# EAGLE design DualMotorBoard (EAGLE 8.5.0)
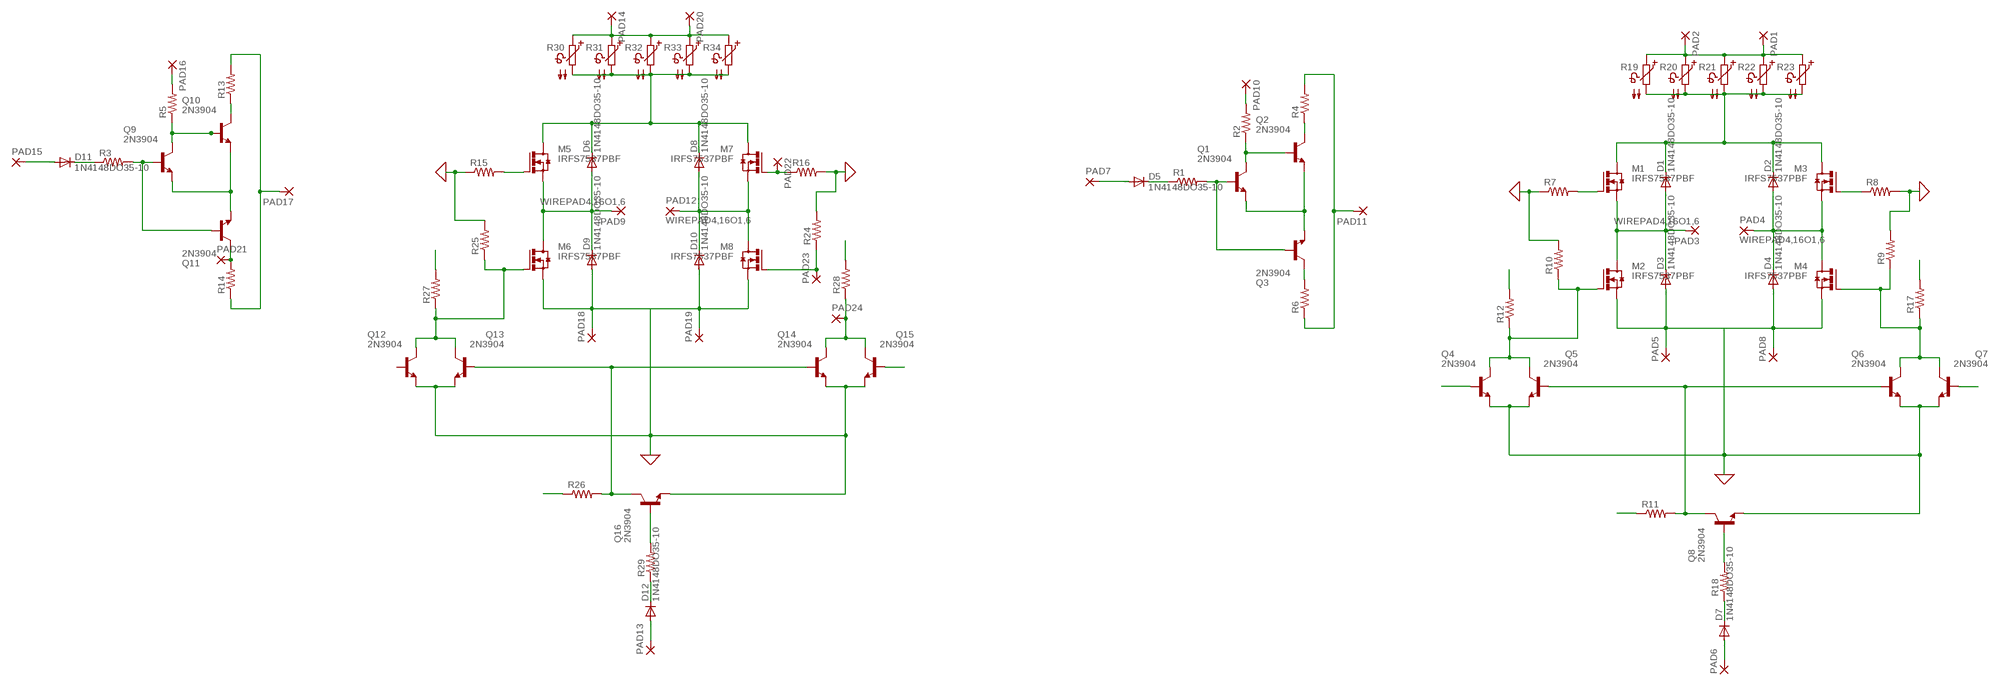
[diagram p0: schematic, sheet 1]

## Parts
D1  1N4148DO35-10  [DO35-10]
D2  1N4148DO35-10  [DO35-10]
D3  1N4148DO35-10  [DO35-10]
D4  1N4148DO35-10  [DO35-10]
D5  1N4148DO35-10  [DO35-10]
D6  1N4148DO35-10  [DO35-10]
D7  1N4148DO35-10  [DO35-10]
D8  1N4148DO35-10  [DO35-10]
D9  1N4148DO35-10  [DO35-10]
D10  1N4148DO35-10  [DO35-10]
D11  1N4148DO35-10  [DO35-10]
D12  1N4148DO35-10  [DO35-10]
M1  IRFS7537PBF  [D2PACK]
M2  IRFS7537PBF  [D2PACK]
M3  IRFS7537PBF  [D2PACK]
M4  IRFS7537PBF  [D2PACK]
M5  IRFS7537PBF  [D2PACK]
M6  IRFS7537PBF  [D2PACK]
M7  IRFS7537PBF  [D2PACK]
M8  IRFS7537PBF  [D2PACK]
PAD1  3,81/1,4  [3,81/1,4]
PAD2  3,81/1,4  [3,81/1,4]
PAD3  WIREPAD4,16O1,6  [4,16O1,6]
PAD4  WIREPAD4,16O1,6  [4,16O1,6]
PAD5  3,81/1,4  [3,81/1,4]
PAD6  2,54/1,1  [2,54/1,1]
PAD7  2,54/1,0  [2,54/1,0]
PAD8  3,81/1,4  [3,81/1,4]
PAD9  WIREPAD4,16O1,6  [4,16O1,6]
PAD10  2,54/1,1  [2,54/1,1]
PAD11  2,54/1,1  [2,54/1,1]
PAD12  WIREPAD4,16O1,6  [4,16O1,6]
PAD13  2,54/1,1  [2,54/1,1]
PAD14  3,81/1,4  [3,81/1,4]
PAD15  2,54/1,0  [2,54/1,0]
PAD16  2,54/1,1  [2,54/1,1]
PAD17  2,54/1,1  [2,54/1,1]
PAD18  3,81/1,4  [3,81/1,4]
PAD19  3,81/1,4  [3,81/1,4]
PAD20  3,81/1,4  [3,81/1,4]
PAD21  2,54/1,1  [2,54/1,1]
PAD22  2,54/1,1  [2,54/1,1]
PAD23  2,54/1,1  [2,54/1,1]
PAD24  2,54/1,1  [2,54/1,1]
Q1  2N3904  [TO92]
Q2  2N3904  [TO92]
Q3  2N3904  [TO92]
Q4  2N3904  [TO92]
Q5  2N3904  [TO92]
Q6  2N3904  [TO92]
Q7  2N3904  [TO92]
Q8  2N3904  [TO92]
Q9  2N3904  [TO92]
Q10  2N3904  [TO92]
Q11  2N3904  [TO92]
Q12  2N3904  [TO92]
Q13  2N3904  [TO92]
Q14  2N3904  [TO92]
Q15  2N3904  [TO92]
Q16  2N3904  [TO92]
R1  R-US_0207/7  [0207/7]
R2  R-US_0207/7  [0207/7]
R3  R-US_0207/7  [0207/7]
R4  R-US_0207/7  [0207/7]
R5  R-US_0207/7  [0207/7]
R6  R-US_0207/7  [0207/7]
R7  R-US_0207/7  [0207/7]
R8  R-US_0207/7  [0207/7]
R9  R-US_0207/7  [0207/7]
R10  R-US_0207/7  [0207/7]
R11  R-US_0207/7  [0207/7]
R12  R-US_0207/7  [0207/7]
R13  R-US_0207/7  [0207/7]
R14  R-US_0207/7  [0207/7]
R15  R-US_0207/7  [0207/7]
R16  R-US_0207/12  [0207/12]
R17  R-US_0207/7  [0207/7]
R18  R-US_0207/7  [0207/7]
R19  PTC660A  [P660A]
R20  PTC660A  [P660A]
R21  PTC660A  [P660A]
R22  PTC660A  [P660A]
R23  PTC660A  [P660A]
R24  R-US_0207/12  [0207/12]
R25  R-US_0207/7  [0207/7]
R26  R-US_0207/7  [0207/7]
R27  R-US_0207/7  [0207/7]
R28  R-US_0207/7  [0207/7]
R29  R-US_0207/7  [0207/7]
R30  PTC660A  [P660A]
R31  PTC660A  [P660A]
R32  PTC660A  [P660A]
R33  PTC660A  [P660A]
R34  PTC660A  [P660A]

## Nets
0: D3.A D4.A D9.A D10.A M2.3(S) M4.3(S) M6.3(S) M8.3(S) PAD5.1(P) PAD8.1(P) PAD18.1(P) PAD19.1(P) Q1.3(E) Q2.3(E) Q3.3(E) Q4.3(E) Q5.3(E) Q6.3(E) Q7.3(E) Q8.3(E) Q9.3(E) Q10.3(E) Q11.3(E) Q12.3(E) Q13.3(E) Q14.3(E) Q15.3(E) Q16.3(E) R7.1 R8.2 R9.2 R10.2 R15.1 R16.2 R24.2 R25.2 ; supply symbol labelled GND
BB: Q1.2(B) Q3.2(B) Q4.2(B) R1.2
BB1: Q9.2(B) Q11.2(B) R3.2
BF: M3.1(G) Q3.1(C) R6.2 R8.1
BFF: PAD21.1(P) Q11.1(C) R14.2
BFG: M7.1(G) PAD22.1(P) R16.1
DIR: D5.A PAD7.1(P)
DIR1: D11.A PAD15.1(P)
FB: Q1.1(C) Q2.2(B) Q7.2(B) R2.1
FB1: Q9.1(C) Q10.2(B) Q15.2(B) R5.1
FF: M1.1(G) Q2.1(C) R4.1 R7.2
FF1: M5.1(G) Q10.1(C) R13.1 R15.2
MN: D2.A D4.C M3.3(S) M4.2(D) PAD4.1(P)
MN1: D8.A D10.C M7.3(S) M8.2(D) PAD12.1(P)
MP: D1.A D3.C M1.3(S) M2.2(D) PAD3.1(P)
MP1: D6.A D9.C M5.3(S) M6.2(D) PAD9.1(P)
N$1: M8.1(G) PAD23.1(P) R24.1
N$2: D7.C R18.1
N$3: M6.1(G) Q12.1(C) Q13.1(C) R25.1 R27.1
N$4: D7.A PAD6.1(P)
N$5: PAD24.1(P) Q14.1(C) Q15.1(C) R28.1
N$6: Q13.2(B) Q14.2(B) Q16.1(C) R26.2
N$7: Q16.2(B) R29.2
N$8: D11.C R3.1
N$10: D12.C R29.1
N$11: D12.A PAD13.1(P)
N$16: Q5.2(B) Q6.2(B) Q8.1(C) R11.2
N$19: D5.C R1.1
N$20: M2.1(G) Q4.1(C) Q5.1(C) R10.1 R12.1
N$23: Q8.2(B) R18.2
N$27: M4.1(G) Q6.1(C) Q7.1(C) R9.1 R17.1
VBAT: PAD1.1(P) PAD2.1(P) PAD14.1(P) PAD20.1(P) R19.1 R20.1 R21.1 R22.1 R23.1 R30.1 R31.1 R32.1 R33.1 R34.1
VDD: D1.C D2.C M1.2(D) M3.2(D) R19.2 R20.2 R21.2 R22.2 R23.2
VDD1: D6.C D8.C M5.2(D) M7.2(D) R30.2 R31.2 R32.2 R33.2 R34.2
VG: PAD11.1(P) R4.2 R6.1 R12.2 R17.2
VG1: PAD17.1(P) R13.2 R14.1 R27.2 R28.2
VSW: PAD10.1(P) R2.2 R11.1
VSW1: PAD16.1(P) R5.2 R26.1
Unconnected: Q12.2(B)

## Library data of the parts
D1-D12 = diode:1N4148: DIODE high speed (Philips)
M1-M8 = EagleCAD:IRFS7537PBF: IRFS7537PBF Infineon International Rectifier DATASHEET: http://www.infineon.com/dgdl/irfs7537pbf.pdf?fileId=5546d462533600a4015364c3ee2729cb
PAD1 PAD2 PAD5 PAD8 PAD14 PAD18-PAD20 = wirepad:3,81/1,4: THROUGH-HOLE PAD
PAD3 PAD4 PAD9 PAD12 = wirepad:WIREPAD: Wire PAD connect wire on PCB
PAD6 PAD10 PAD11 PAD13 PAD16 PAD17 PAD21-PAD24 = wirepad:2,54/1,1: THROUGH-HOLE PAD
PAD7 PAD15 = wirepad:2,54/1,0: THROUGH-HOLE PAD
Q1-Q16 = transistor-npn:2N3904: NPN Transistor
R1-R13 R18 R26 R27 R29 = rcl:R-US_: RESISTOR, American symbol; SPICEPREFIX: R
R14-R17 R24 R25 R28 = resistor:R-US_: RESISTOR, American symbol
R19-R23 R30-R34 = ptc-ntc:PTC660A: PHILIPS PTC; OC_FARNELL: unknown; OC_NEWARK: unknown

## Board
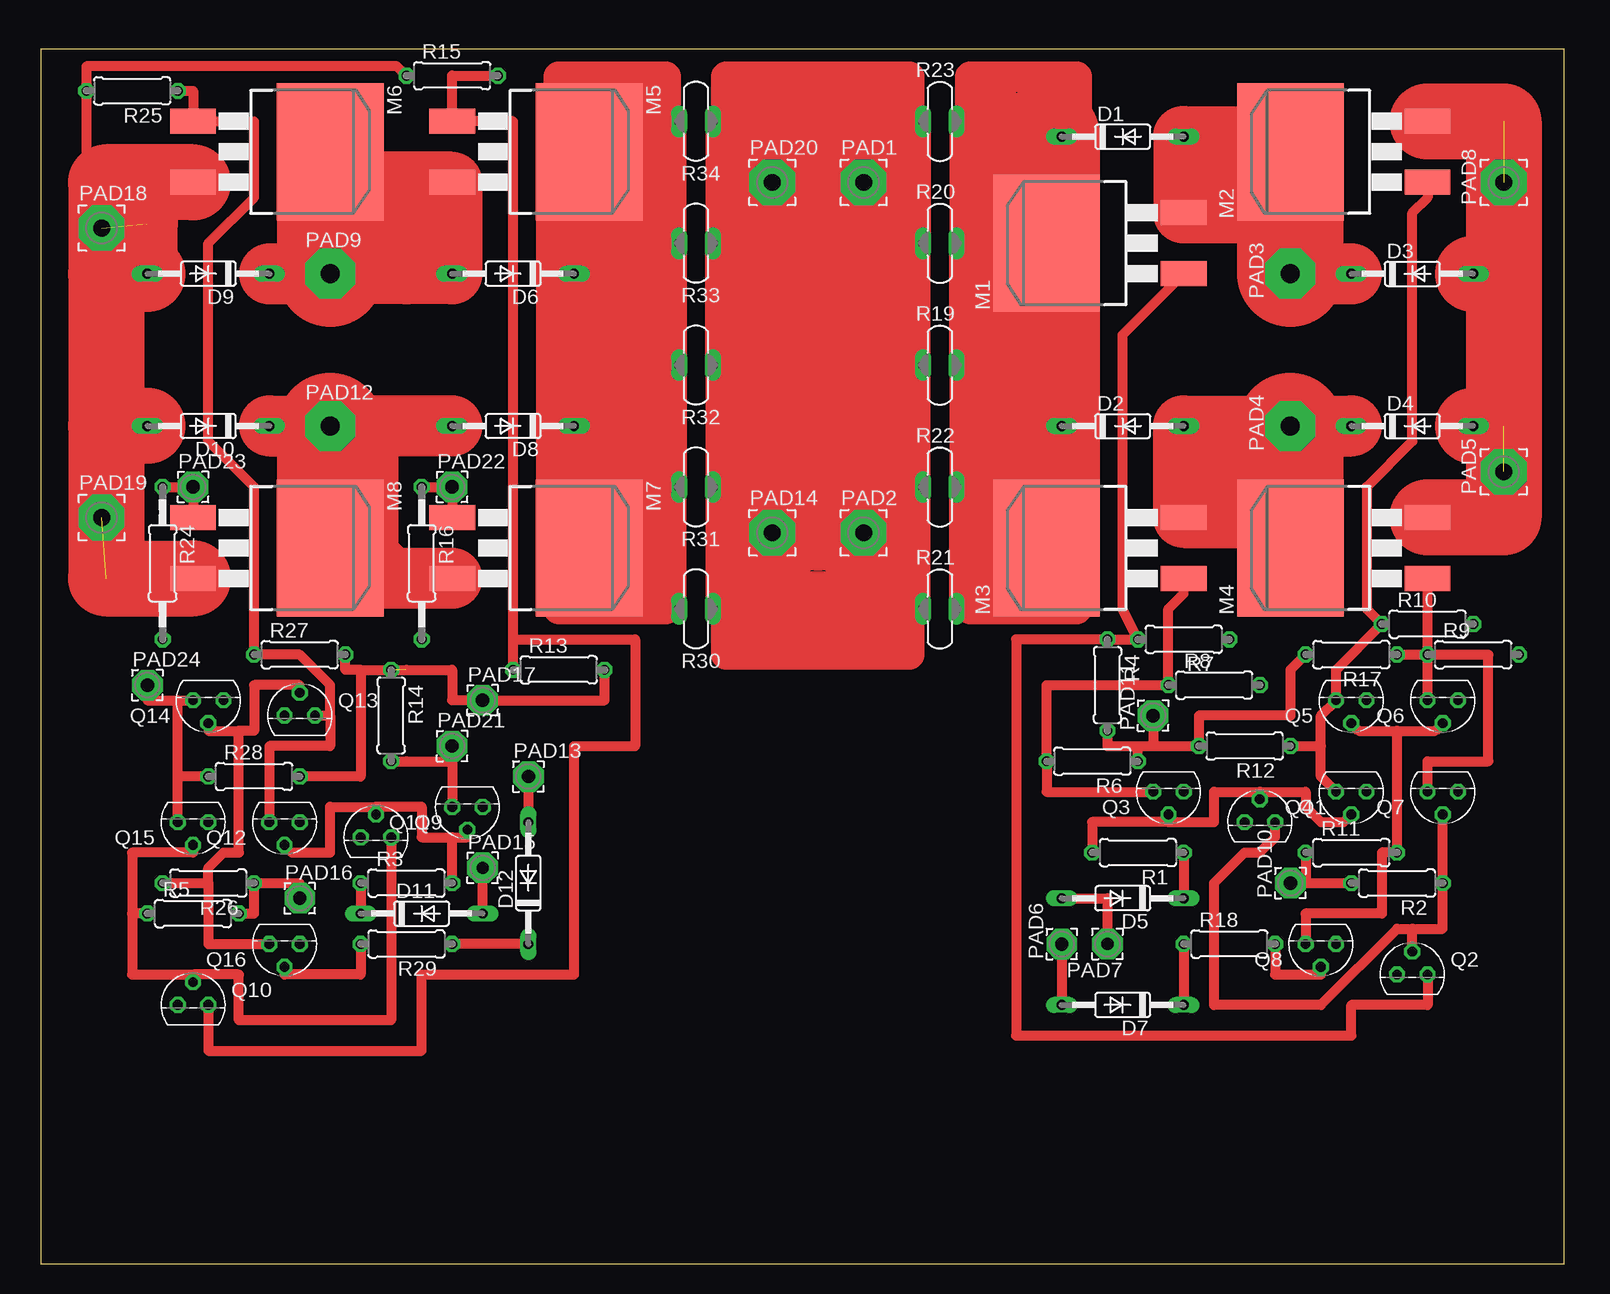
[diagram p1: board, top side]
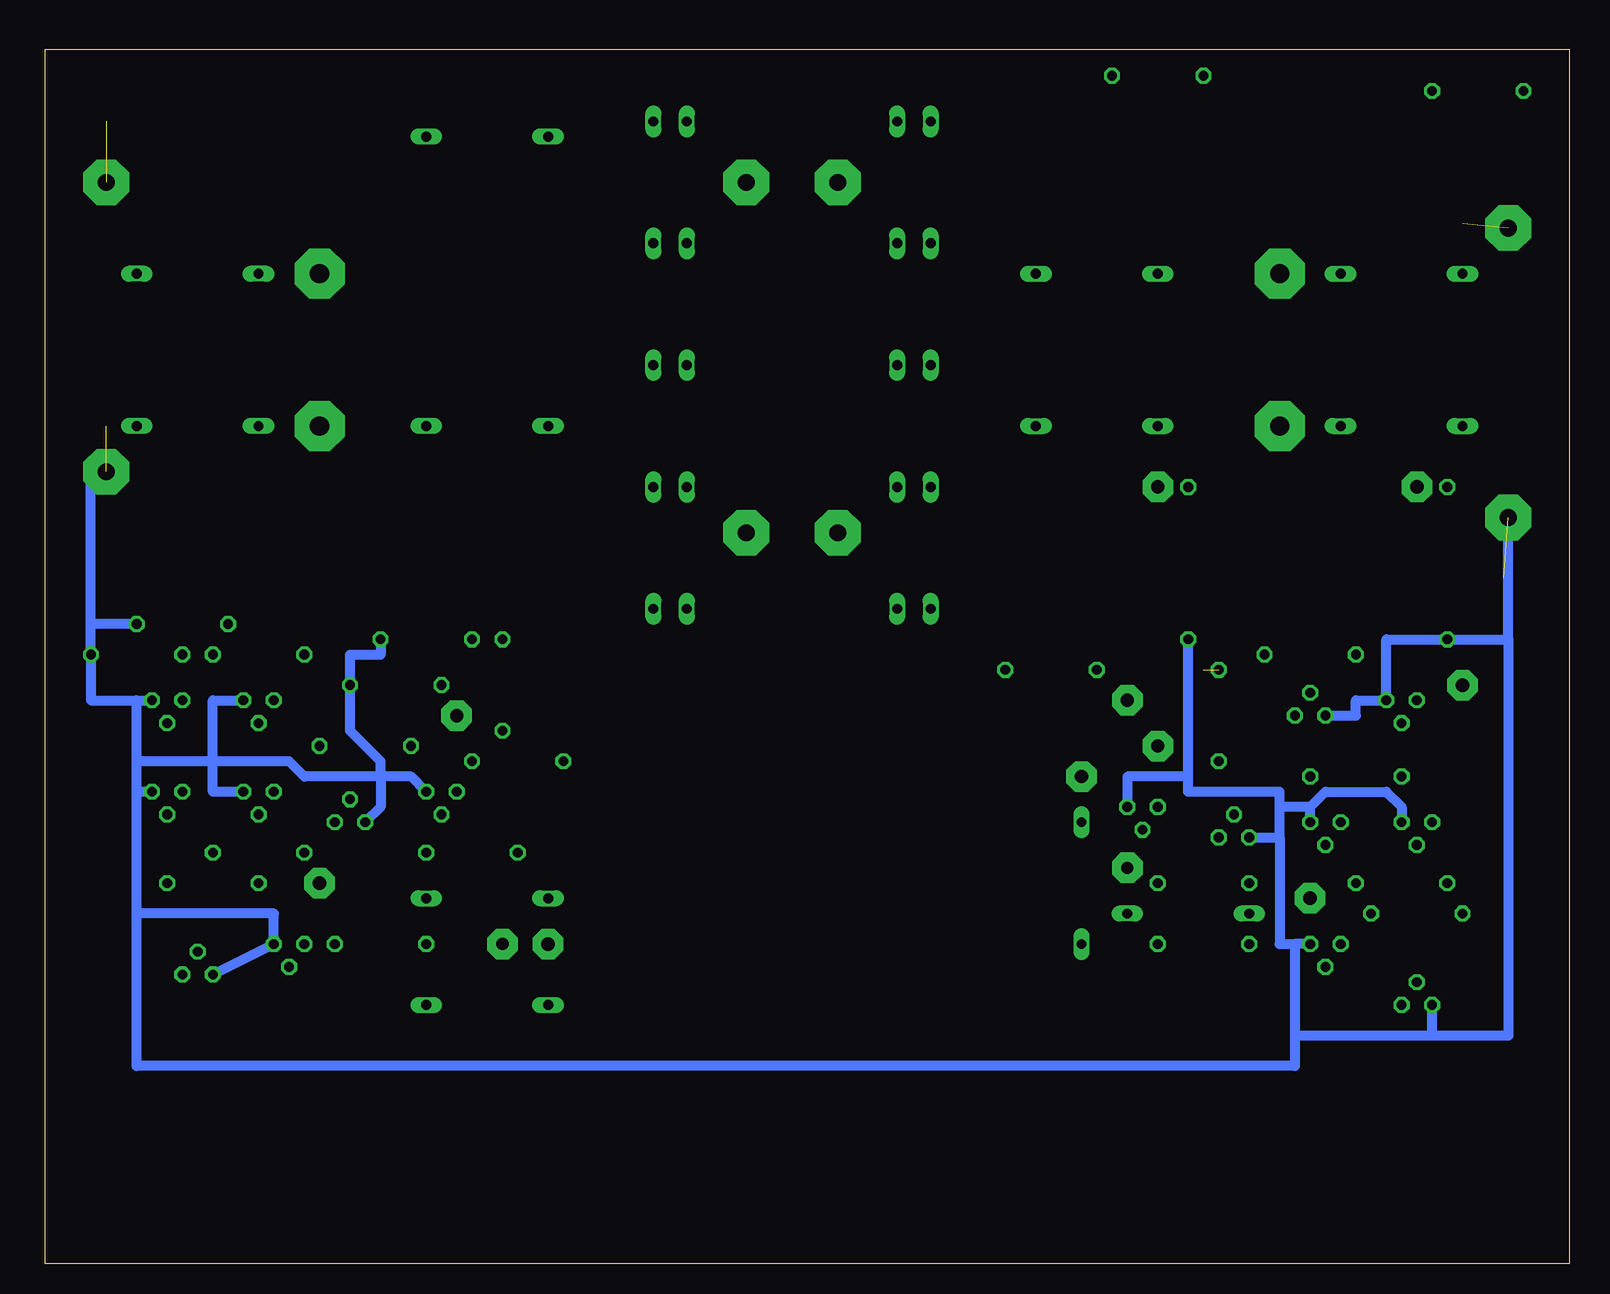
[diagram p2: board, bottom side, seen from below]

Size 126.98 x 101.27 mm. Coordinates in mm from the lower left corner, seen from the top.
Outline: 0,0 126.98,0 126.98,101.27 0,101.27 0,0
Copper layers (1*16): Top 0.035mm / dielectric 1.5mm / Bottom 0.035mm
Design rules "default": minimum track width 6mil, minimum drill 0.35mm, track to track 6mil, track to pad 6mil, pad to pad 6mil, via to via 6mil, smd to smd 6mil, copper to edge 40mil, drill to drill 6mil, minimum pad ring 10mil, minimum via ring 8mil, stop-mask expansion 4mil, vias tented up to drill 0mil, thermal gap 10mil

### Footprints (pad centres in the part's own frame; a part is rotated, then mirrored left to right if it is on the bottom)
DO35-10 = drill 0.813 long: A 5.08,0; C -5.08,0
D2PACK = smd 2.083 x 3.81: 1 -2.54,-8.89; 3 2.54,-8.89 | smd 11.43 x 8.89: 2 0,2.54
3,81/1,4 = drill 1.397 pad 3.81 octagon: 1 0,0
4,16O1,6 = drill 1.6 pad 4.166 octagon: 1 0,0
2,54/1,1 = drill 1.118 pad 2.54 octagon: 1 0,0
2,54/1,0 = drill 1.016 pad 2.54 octagon: 1 0,0
TO92 = drill 0.813 octagon: 1 1.27,0; 2 0,1.905; 3 -1.27,0
0207/7 = drill 0.813 octagon: 1 -3.81,0; 2 3.81,0
0207/12 = drill 0.813 octagon: 1 -6.35,0; 2 6.35,0
P660A = drill 0.813 long: 1 -1.397,0; 2 1.397,0

### Placement (x,y rotation side)
D1  90.17,93.98 0 top
D2  90.17,69.85 0 top
D3  114.3,82.55 0 top
D4  114.3,69.85 0 top
D5  90.17,30.48 180 top
D6  39.37,82.55 180 top
D7  90.17,21.59 180 top
D8  39.37,69.85 180 top
D9  13.97,82.55 180 top
D10  13.97,69.85 180 top
D11  31.75,29.21 0 top
D12  40.64,31.75 90 top
M1  86.36,85.09 90 top
M2  106.68,92.71 90 top
M3  86.36,59.69 90 top
M4  106.68,59.69 90 top
M5  43.18,92.71 270 top
M6  21.59,92.71 270 top
M7  43.18,59.69 270 top
M8  21.59,59.69 270 top
PAD1  68.58,90.17 0 top
PAD2  68.58,60.96 0 top
PAD3  104.14,82.55 90 top
PAD4  104.14,69.85 90 top
PAD5  121.92,66.04 90 top
PAD6  85.09,26.67 90 top
PAD7  88.9,26.67 180 top
PAD8  121.92,90.17 90 top
PAD9  24.13,82.55 0 top
PAD10  104.14,31.75 90 top
PAD11  92.71,45.72 90 top
PAD12  24.13,69.85 0 top
PAD13  40.64,40.64 0 top
PAD14  60.96,60.96 0 top
PAD15  36.83,33.02 0 top
PAD16  21.59,30.48 0 top
PAD17  36.83,46.99 0 top
PAD18  5.08,86.36 0 top
PAD19  5.08,62.23 0 top
PAD20  60.96,90.17 0 top
PAD21  34.29,43.18 0 top
PAD22  34.29,64.77 0 top
PAD23  12.7,64.77 0 top
PAD24  8.89,48.26 0 top
Q1  101.6,36.83 0 top
Q2  114.3,24.13 0 top
Q3  93.98,39.37 180 top
Q4  109.22,39.37 180 top
Q5  109.22,46.99 180 top
Q6  116.84,46.99 180 top
Q7  116.84,39.37 180 top
Q8  106.68,26.67 180 top
Q9  27.94,35.56 0 top
Q10  12.7,21.59 0 top
Q11  35.56,38.1 180 top
Q12  20.32,36.83 180 top
Q13  21.59,45.72 0 top
Q14  13.97,46.99 180 top
Q15  12.7,36.83 180 top
Q16  20.32,26.67 180 top
R1  91.44,34.29 180 top
R2  113.03,31.75 180 top
R3  30.48,31.75 0 top
R4  88.9,48.26 270 top
R5  12.7,29.21 0 top
R6  87.63,41.91 180 top
R7  95.25,52.07 180 top
R8  97.79,48.26 0 top
R9  119.38,50.8 0 top
R10  115.57,53.34 0 top
R11  109.22,34.29 0 top
R12  100.33,43.18 180 top
R13  43.18,49.53 0 top
R14  29.21,45.72 270 top
R15  34.29,99.06 0 top
R16  31.75,58.42 270 top
R17  109.22,50.8 180 top
R18  99.06,26.67 0 top
R19  74.93,74.93 0 top
R20  74.93,85.09 0 top
R21  74.93,54.61 0 top
R22  74.93,64.77 0 top
R23  74.93,95.25 0 top
R24  10.16,58.42 270 top
R25  7.62,97.79 180 top
R26  13.97,31.75 180 top
R27  21.59,50.8 0 top
R28  17.78,40.64 0 top
R29  30.48,26.67 180 top
R30  54.61,54.61 180 top
R31  54.61,64.77 180 top
R32  54.61,74.93 180 top
R33  54.61,85.09 180 top
R34  54.61,95.25 180 top

### Tracks (layer width: path | path; a pad name or v marks a point on that pad's centre or on a via)
0  (4 unrouted)
  Top 0.813: 5.46,90.17 3.81,90.17 R25.2 3.81,99.85 29.69,99.85 R15.1
  Top 5.08: D9.A 8.89,86.74 5.46,90.17
  Top 6.35: 121.92,82.55 121.92,95.25 M2.3 | 121.92,82.55 121.92,69.85 | 121.92,69.85 121.92,62.23 M4.3 | D4.A 121.92,69.85 | D3.A 121.92,82.55 | M6.3 5.46,90.17 5.46,82.55 | 5.46,82.55 5.46,69.85 | 5.46,69.85 5.46,57.15 M8.3 | D10.A 5.46,69.85 | D9.A 5.46,82.55
  Bottom 0.813: Q7.3 119.38,39.37 | 119.38,39.37 119.38,41.91 | 119.38,41.91 119.38,46.99 | 119.38,46.99 Q6.3 | R9.2 123.19,46.99 119.38,46.99 | 119.38,29.21 119.38,39.37 | R9.2 | R9.2 123.19,53.34 | 99.06,50.8 101.6,50.8 R8.2 101.6,44.45 99.06,41.91 99.06,40.64 | 99.06,50.8 | Q4.3 113.03,39.37 113.03,41.91 | 113.03,41.91 113.03,46.99 Q5.3 | 113.03,41.91 119.38,41.91 | 119.38,29.21 107.95,29.21 Q8.3 Q2.3 | Q3.3 96.52,40.64 99.06,40.64 | 99.06,40.64 99.06,38.1 Q1.3 | R7.1 | R7.1 99.06,50.8 | R10.2 123.19,53.34 | 123.19,53.34 123.19,66.04 PAD5.1 | 99.06,40.64 105.41,40.64 106.68,41.91 113.03,41.91 | 5.08,52.07 R24.2 15.24,52.07 Q14.3 17.78,46.99 17.78,45.72 Q13.3 | 5.08,52.07 PAD19.1 | Q9.3 24.13,35.56 | 24.13,35.56 24.13,38.1 | Q11.3 36.83,40.64 31.75,40.64 | Q16.3 22.86,26.67 | 22.86,26.67 22.86,19.05 | 22.86,19.05 11.43,19.05 | 11.43,19.05 Q10.3 | 24.13,35.56 24.13,26.67 22.86,26.67 | 31.75,40.64 R16.2 | Q15.3 13.97,38.1 15.24,39.37 20.32,39.37 21.59,38.1 | Q12.3 21.59,38.1 | 21.59,38.1 24.13,38.1 | 22.86,19.05 22.86,16.51 119.38,16.51 119.38,29.21 | 31.75,40.64 31.75,39.37 24.13,39.37 24.13,38.1 | 11.43,19.05 5.08,19.05 5.08,52.07
BB
  Top 0.813: Q4.2 108.58,36.83 106.68,36.83 105.41,38.1 105.41,39.37 101.6,39.37 | 93.98,36.83 87.63,36.83 R1.2 | 93.98,36.83 97.79,36.83 97.79,39.37 101.6,39.37 | Q3.2 93.98,36.83 | Q1.2 101.6,39.37
BB1
  Top 0.813: 27.94,38.1 31.75,38.1 31.75,35.56 34.29,35.56 | 27.94,38.1 Q9.2 | 27.94,38.1 24.13,38.1 24.13,34.29 20.95,34.29 | 34.29,35.56 35.56,35.56 Q11.2 | R3.2 34.29,35.56
BF
  Top 0.813: Q3.1 83.82,39.37 R6.2 83.82,48.26 R8.1 93.98,54.61 95.25,55.88 M3.1
BFF  (1 unrouted)
  Top 0.813: PAD21.1 34.29,41.91 | 34.29,41.91 Q11.1 | 30.48,41.91 | 30.48,41.91 34.29,41.91 | R14.2 30.48,41.91
BFG
  Top 0.813: R16.1 PAD22.1 M7.1
DIR
  Top 0.813: D5.A 88.9,30.48 PAD7.1
DIR1
  Top 0.813: D11.A PAD15.1
FB
  Top 0.813: Q7.2 R2.1 116.84,27.94 114.3,27.94 | 114.3,27.94 113.03,27.94 106.68,21.59 97.79,21.59 97.79,31.75 100.33,34.29 101.6,34.29 102.87,35.56 Q1.1 | Q2.2 114.3,27.94
FB1
  Top 0.813: Q15.2 12.7,34.29 7.62,34.29 7.62,29.21 | 12.7,24.13 7.62,24.13 7.62,29.21 | 12.7,24.13 Q10.2 | Q9.1 29.21,20.32 16.51,20.32 16.51,24.13 12.7,24.13 | R5.1 7.62,29.21
FF
  Top 0.813: M1.1 90.17,77.47 90.17,54.61 R7.2 | R7.2 | R7.2 R4.1 81.28,52.07 81.28,19.05 109.22,19.05 109.22,21.59 115.57,21.59 Q2.1
FF1
  Top 0.813: R15.2 34.29,99.06 M5.1 39.37,95.25 39.37,52.07 | R13.1 39.37,52.07 | Q10.1 13.97,17.78 31.75,17.78 31.75,24.13 44.45,24.13 44.45,43.18 49.53,43.18 49.53,52.07 39.37,52.07
MN
  Top 5.08: PAD4.1 D2.A 95.25,66.04 | M4.2 101.6,62.23 M3.3 95.25,66.04 | PAD4.1 D4.C | 95.25,66.04 102.87,66.04 104.14,67.31 PAD4.1
  Top 8.89: M4.2 PAD4.1
MN1
  Top 1.27: 29.21,57.15 29.21,63.5
  Top 5.08: D10.C PAD12.1 25.4,68.58 27.94,69.85 D8.A | M7.3 29.21,57.15 | 29.21,57.15 24.13,57.15 M8.2 | 27.94,58.42 29.21,57.15
  Top 6.35: M8.2 26.67,62.23 26.67,67.31
  Top 8.89: M8.2 PAD12.1
MP
  Top 5.08: M2.2 104.14,95.25 102.87,93.98 D1.A M1.3 | M1.3 104.14,87.63 | D3.C PAD3.1 104.14,88.9 102.87,90.17 97.79,90.17 M1.3
  Top 8.89: PAD3.1 104.14,87.63 M2.2
MP1
  Top 5.08: D9.C PAD9.1 30.48,82.55 | 30.48,90.17 M5.3 D6.A 30.48,82.55 | 30.48,90.17 25.4,90.17 24.13,88.9 | 30.48,90.17 30.48,82.55
  Top 8.89: M6.2 24.13,88.9 PAD9.1
N$1
  Top 0.813: R24.1 PAD23.1 M8.1
N$2
  Top 0.813: R18.1 D7.C
N$3
  Top 0.813: R25.1 12.7,97.79 M6.1 17.78,95.25 17.78,88.9 13.97,85.09 13.97,68.58 17.78,64.77 R27.1 21.59,50.8 24.13,48.26 24.13,45.72 | Q12.1 19.05,43.18 24.13,43.18 24.13,45.72 | Q13.1 24.13,45.72
N$4
  Top 0.813: PAD6.1 D7.A
N$5
  Top 0.813: Q15.1 11.43,40.64 | 11.43,40.64 11.43,46.99 | 11.43,46.99 Q14.1 | R28.1 11.43,40.64 | PAD24.1 8.89,46.99 11.43,46.99
N$6
  Top 0.813: Q14.2 13.97,44.45 16.51,44.45 | 13.97,31.75 13.97,33.02 15.24,34.29 16.51,34.29 16.51,44.45 | R26.2 13.97,31.75 | Q13.2 21.59,48.26 17.78,48.26 17.78,44.45 16.51,44.45 | Q16.1 13.97,26.67 13.97,31.75
N$7
  Top 0.813: R29.2 26.67,24.13 20.32,24.13 Q16.2
N$8
  Top 0.813: R3.1 D11.C
N$10
  Top 0.813: D12.C R29.1
N$11
  Top 0.813: PAD13.1 D12.A
N$16
  Top 0.813: Q5.2 109.86,44.45 113.03,44.45 | Q6.2 116.2,44.45 113.03,44.45 | 113.03,44.45 R11.2 111.76,34.29 111.76,29.21 105.41,29.21 Q8.1
N$19
  Top 0.813: R1.1 D5.C
N$20
  Top 0.813: Q4.1 106.68,40.64 106.68,43.18 | 106.68,43.18 106.68,45.72 Q5.1 107.95,49.53 R10.1 110.49,54.61 110.49,64.77 114.3,68.58 114.3,87.63 115.57,88.9 M2.1 | R12.1 106.68,43.18
N$23
  Top 0.813: R18.2 102.87,24.13 106.68,24.13 Q8.2
N$27
  Top 0.813: Q6.1 R9.1 | R9.1 M4.1 | Q7.1 115.57,41.91 120.65,41.91 120.65,50.8 R9.1 | R17.1 R9.1
VBAT
  Top 1.27: R19.1 R20.1 | R22.1 R19.1 | R22.1 R21.1 72.39,54.61 68.58,54.61 | R20.1 R23.1 72.39,95.25 69.85,95.25 68.58,96.52 | R33.1 R34.1 57.15,95.25 59.69,95.25 60.96,96.52 | R32.1 R33.1 | R32.1 R31.1 | R31.1 R30.1 57.15,54.61 58.42,54.61 | R31.1 57.15,64.77 60.96,64.77 | R32.1 57.15,74.93 64.77,74.93 | R33.1 57.15,85.09 64.77,85.09 | R20.1 72.39,85.09 68.58,85.09 | R19.1 72.39,74.93 68.58,74.93 | R22.1 72.39,64.77 68.58,64.77
  Top 2.54: 57.15,52.07 57.15,54.61 57.15,64.77 57.15,74.93 57.15,85.09 57.15,95.25 57.15,98.98 72.39,98.98 72.39,95.25 72.39,85.09 72.39,74.93 72.39,64.77 72.39,54.61 72.39,52.07 | 57.15,52.07 72.39,52.07 | 57.15,52.07 57.15,50.8 72.39,50.8 72.39,52.07
  Top 6.35: PAD20.1 60.96,64.77 PAD14.1 | PAD2.1 64.77,60.96 | 64.77,60.96 PAD14.1 | PAD1.1 68.58,85.09 68.58,74.93 68.58,64.77 PAD2.1 | PAD20.1 64.77,90.17 | 64.77,90.17 PAD1.1 | 64.77,90.17 64.77,85.09 64.77,74.93 64.77,60.96 | PAD14.1 60.96,54.61 68.58,54.61 PAD2.1 | PAD20.1 60.96,96.52 68.58,96.52 PAD1.1
VDD
  Top 1.27: R20.2 R23.2 77.47,95.25 78.74,95.25 80.01,95.25 83.82,95.25 D1.C | R19.2 R20.2 | R19.2 R22.2 | R22.2 R21.2 77.47,54.61 | 78.74,54.61 83.82,54.61 M3.2 | R22.2 77.47,64.77 78.74,64.77 82.55,64.77 83.82,66.04 | R19.2 77.47,74.93 78.74,74.93 83.82,74.93 | R20.2 77.47,85.09 78.74,85.09 85.09,85.09
  Top 2.54: 85.09,74.93 D2.C | 80.01,98.98 86.36,98.98 86.36,96.52 83.82,93.98 | 80.01,98.98 78.74,98.98 | 78.74,98.98 77.47,98.98 77.47,95.25 77.47,85.09 77.47,74.93 77.47,64.77 77.47,54.61 78.74,54.61 | 78.74,98.98 78.74,95.25 78.74,85.09 78.74,74.93 78.74,64.77 78.74,54.61 | 80.01,98.98 80.01,95.25 | 78.74,54.61 86.36,54.61
  Top 5.08: D2.C 83.82,68.58 83.82,66.04 | D1.C 85.09,85.09 M1.2
  Top 8.89: M3.2 83.82,66.04 83.82,74.93 M1.2 83.82,93.98
VDD1
  Top 1.27: R31.2 R30.2 52.07,54.61 50.8,54.61 48.26,54.61 45.72,57.15 M7.2 | R32.2 R31.2 | R33.2 R32.2 | R33.2 R34.2 52.07,95.25 50.8,95.25 45.72,95.25 M5.2 | R33.2 52.07,85.09 50.8,85.09 48.26,85.09 45.72,82.55 | R32.2 52.07,74.93 50.8,74.93 45.72,74.93 | R31.2 52.07,64.77 50.8,64.77 46.99,64.77 44.45,67.31 D8.C
  Top 2.54: D6.C 45.72,82.55 | D8.C 45.72,68.58 | M5.2 43.18,95.25 43.18,98.98 50.8,98.98 | 50.8,98.98 52.07,98.98 52.07,95.25 52.07,85.09 52.07,74.93 52.07,64.77 52.07,54.61 43.18,54.61 43.18,59.69 M7.2 48.26,59.69 | 50.8,98.98 50.8,95.25 50.8,85.09 50.8,74.93 50.8,64.77 50.8,54.61
  Top 8.89: M7.2 45.72,68.58 45.72,74.93 45.72,82.55 M5.2
VG
  Top 0.813: R6.1 91.44,43.18 | 91.44,43.18 92.71,43.18 | 92.71,43.18 R12.2 96.52,45.72 104.14,45.72 104.14,49.53 R17.2 | R4.2 88.9,43.18 91.44,43.18 | PAD11.1 92.71,43.18
VG1  (1 unrouted)
  Top 0.813: R13.2 46.99,46.99 PAD17.1 34.29,46.99 34.29,49.53 | 26.67,49.53 25.4,49.53 R27.2 | R28.2 26.67,40.64 26.67,49.53 | 30.48,49.53 | 30.48,49.53 34.29,49.53 | 34.29,49.53 | 26.67,49.53 30.48,49.53 | 30.48,49.53
VSW
  Top 0.813: PAD10.1 105.41,31.75 | 105.41,31.75 R2.2 | R11.1 105.41,31.75
VSW1
  Top 0.813: R5.2 17.78,29.21 R26.1 21.59,31.75 PAD16.1